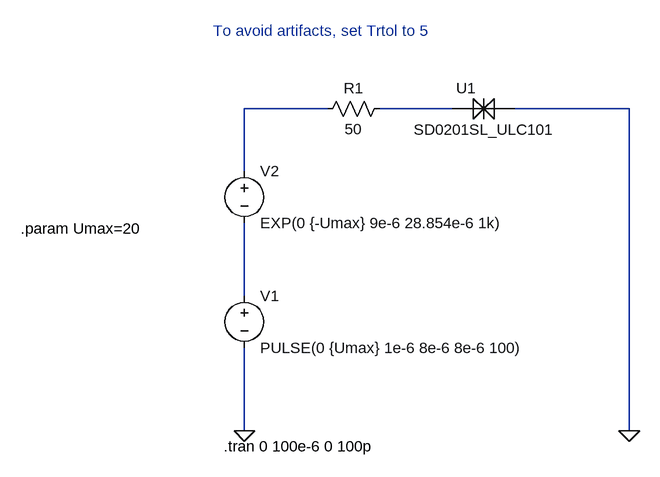
[diagram p0: schematic example1.asc]
example1.asc, the LTspice schematic file:
Version 4
SHEET 1 880 680
WIRE 64 -224 -64 -224
WIRE 256 -224 144 -224
WIRE 528 -224 352 -224
WIRE -64 -128 -64 -224
WIRE -64 64 -64 -48
WIRE -64 272 -64 144
WIRE 528 272 528 -224
FLAG -64 272 0
FLAG 528 272 0
SYMBOL voltage -64 48 R0
WINDOW 123 0 0 Left 0
WINDOW 39 0 0 Left 0
SYMATTR InstName V1
SYMATTR Value PULSE(0 {Umax} 1e-6 8e-6 8e-6 100)
SYMBOL voltage -64 -144 R0
WINDOW 123 0 0 Left 0
WINDOW 39 0 0 Left 0
SYMATTR InstName V2
SYMATTR Value EXP(0 {-Umax} 9e-6 28.854e-6 1k)
SYMBOL TDK\\TVS 304 -224 R0
SYMATTR InstName U1
SYMBOL res 160 -240 R90
WINDOW 0 0 56 VBottom 2
WINDOW 3 32 56 VTop 2
SYMATTR InstName R1
SYMATTR Value 50
TEXT -96 296 Left 2 !.tran 0 100e-6 0 100p
TEXT -408 -40 Left 2 !.param Umax=20
TEXT -112 -344 Left 2 ;To avoid artifacts, set Trtol to 5

The netlist it stands for:
* example1.asc
V1 N003 0 PULSE(0 {Umax} 1e-6 8e-6 8e-6 100)
V2 N001 N003 EXP(0 {-Umax} 9e-6 28.854e-6 1k)
XU1 N002 0 SD0201SL_ULC101  ; pins P1 P2
R1 N002 N001 50
.tran 0 100e-6 0 100p
.param Umax=20
* To avoid artifacts, set Trtol to 5
.lib TVS.sub
.backanno
.end